# EAGLE design Master_copy_v7 (EAGLE 9.6.2)

## Sheet 1 of 2
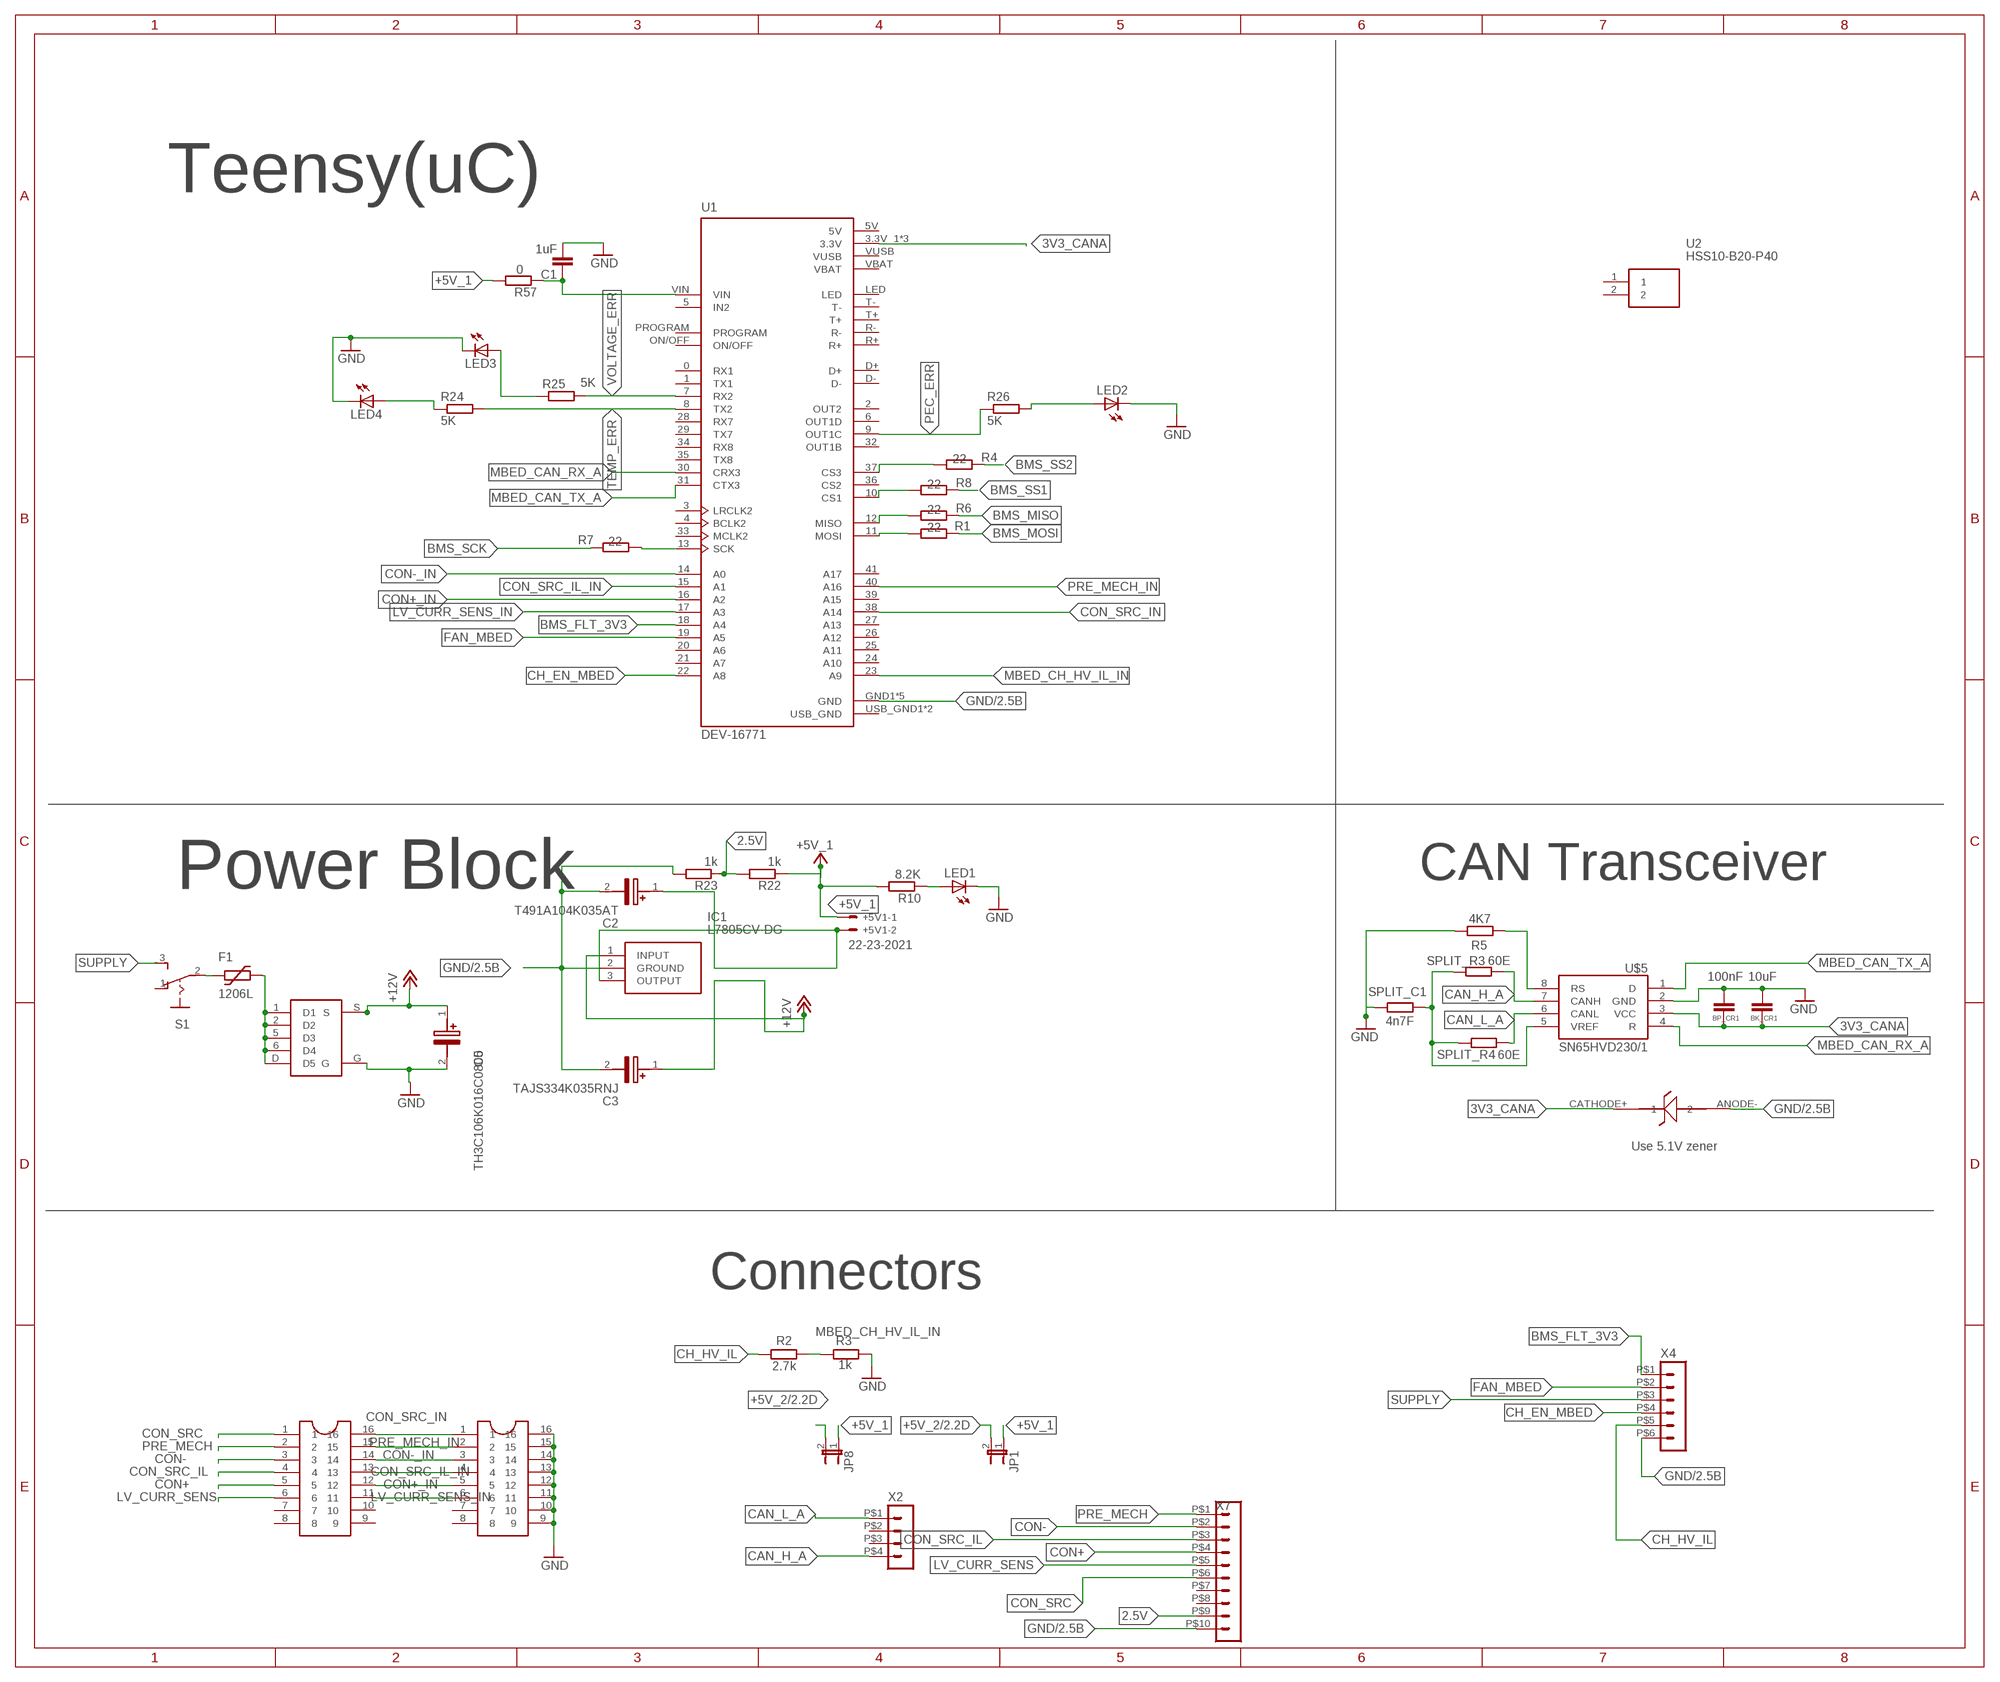
[diagram p0: schematic, sheet 1]

### Parts
+5V1  22-23-2021  [22-23-2021]
BK_CR1  10uF  C-EUC0805  [C0805]
BP_CR1  100nF  C-EUC0805  [C0805]
C1  1uF  C-EUC0805K  [C0805K]
C2  T491A104K035AT  [T491A]
C3  TAJS334K035RNJ  [CAPPM3216X120N]
C5  TH3C106K016C0800  [CAPPM6032X280N]
F1  1206L  [1206L]
IC1  L7805CV-DG  [TO255P460X1020X2008-3P]
JP1  JP1E  [JP1]
JP8  JP1E  [JP1]
LED1  LED  LEDCHIP-LED0805  [CHIP-LED0805]
LED2  LED  LEDCHIP-LED0805  [CHIP-LED0805]
LED3  LED  LEDCHIP-LED0805  [CHIP-LED0805]
LED4  LED  LEDCHIP-LED0805  [CHIP-LED0805]
R1  22  R-EU_R0805  [R0805]
R2  2.7k  R-EU_R0805  [R0805]
R3  1k  R-EU_R0805  [R0805]
R4  22  R-EU_R0805  [R0805]
R5  4K7  R-EU_R0805  [R0805]
R6  22  R-EU_R0805  [R0805]
R7  22  R-EU_R0805  [R0805]
R8  22  R-EU_R0805  [R0805]
R10  8.2K  R-EU_R0805  [R0805]
R22  1k  R-EU_R0805  [R0805]
R23  1k  R-EU_R0805  [R0805]
R24  5K  R-EU_R0805  [R0805]
R25  5K  R-EU_R0805  [R0805]
R26  5K  R-EU_R0805  [R0805]
R57  0  R-EU_R0805  [R0805]
RESISTOR_NET_2.7K  REESISTOR_NET_16  [RESISTOR_NET_16]
S1  STS121PC04  [STS121PC04]
S4  DMP3125L/SQ3419AEEV  [DMP3125L/SQ3419AEEV]
SPLIT_C1  4n7F  R-EU_R0805  [R0805]
SPLIT_R3  60E  R-EU_R0805  [R0805]
SPLIT_R4  60E  R-EU_R0805  [R0805]
U1  DEV-16771  [MODULE_DEV-16771]
U2  HSS10-B20-P40  [HSS10B20P40]
U$5  SN65HVD230/1  [SO8]
U$8  ZENER_DIODE  [SOD323HE]
U$19  REESISTOR_NET_16  [RESISTOR_NET_16]
X2  CON-MOLEX-MICRO-FIT-3_0_HEADER_POS4_43045-0412  [CON-MOLEX-MICRO-FIT-3_0_43045-0412]
X4  HEADER_POS6_43045-0612  [43045-0612]
X7  HEADER_POS10_43045-1012  [43045-1012]

### Nets
2.5V: R22.2 R23.1 X7.P$9
3V3_CANA: BK_CR1.1 BP_CR1.1 U1.3.3V_1(3.3V) U1.3.3V_2(3.3V) U1.3.3V_3(3.3V) U$5.3(VCC) U$8.CATHODE+
+5V_1: +5V1.1 JP1.1 JP8.1 R10.2 R22.1 R57.2
+5V_2: JP1.2 JP8.2 ; also sheet 2
+12V: C3.1(+) C5.1(+) IC1.1(INPUT) S4.S
BMS_FLT_3V3: U1.18(A4) X4.P$1
BMS_MISO: R6.1 ; also sheet 2
BMS_MOSI: R1.1 ; also sheet 2
BMS_SCK: R7.1 ; also sheet 2
BMS_SS1: R8.1 ; also sheet 2
BMS_SS2: R4.1 ; also sheet 2
CAN_H_A: SPLIT_R3.1 U$5.7(CANH) X2.P$4
CAN_L_A: SPLIT_R4.1 U$5.6(CANL) X2.P$1
CH_EN_MBED: U1.22(A8) X4.P$4
CH_HV_IL: R2.1 X4.P$5
CON+: RESISTOR_NET_2.7K.5 X7.P$4
CON+_IN: RESISTOR_NET_2.7K.12 U1.16(A2) U$19.5
CON-: RESISTOR_NET_2.7K.3 X7.P$2
CON-_IN: RESISTOR_NET_2.7K.14 U1.14(A0) U$19.3
CON_SRC: RESISTOR_NET_2.7K.1 X7.P$6
CON_SRC_IL: RESISTOR_NET_2.7K.4 X7.P$3
CON_SRC_IL_IN: RESISTOR_NET_2.7K.13 U1.15(A1) U$19.4
CON_SRC_IN: RESISTOR_NET_2.7K.16 U1.38(A14) U$19.1
FAN_MBED: U1.19(A5) X4.P$2
GND: BK_CR1.2 BP_CR1.2 C1.2 C2.2(-) C3.2(-) C5.2(-) IC1.2(GROUND) LED1.C LED2.C LED3.C LED4.C R3.2 R5.1 R23.2 S4.G SPLIT_C1.2 U1.GND1(GND) U1.GND2(GND) U1.GND3(GND) U1.GND4(GND) U1.GND5(GND) U$5.2(GND) U$8.ANODE- U$19.9 U$19.10 U$19.11 U$19.12 U$19.13 U$19.14 U$19.15 U$19.16 X4.P$6 X7.P$10 ; also sheet 2
LV_CURR_SENS: RESISTOR_NET_2.7K.6 X7.P$5
LV_CURR_SENS_IN: RESISTOR_NET_2.7K.11 U1.17(A3) U$19.6
MBED_CAN_RX_A: U1.30(CRX3) U$5.4(R)
MBED_CAN_TX_A: U1.31(CTX3) U$5.1(D)
MBED_CH_HV_IL_IN: R2.2 R3.1 U1.23(A9)
N$2: R4.2 U1.37(CS3)
N$3: F1.P$1 S1.2(P)
N$4: R5.2 U$5.8(RS)
N$7: R1.2 U1.11(MOSI)
N$8: R6.2 U1.12(MISO)
N$9: R8.2 U1.10(CS1)
N$10: R7.2 U1.13(SCK)
N$11: +5V1.2 C2.1(+) IC1.3(OUTPUT)
N$13: LED1.A R10.1
N$18: LED3.A R25.1
N$21: LED4.A R24.1
N$22: LED2.A R26.2
N$27: SPLIT_C1.1 SPLIT_R3.2 SPLIT_R4.2 U$5.5(VREF)
N$46: F1.P$2 S4.1(D1) S4.2(D2) S4.5(D3) S4.6(D4) S4.D(D5)
N$62: C1.1 R57.1 U1.VIN
PEC_ERR: R26.1 U1.9(OUT1C)
PRE_MECH: RESISTOR_NET_2.7K.2 X7.P$1
PRE_MECH_IN: RESISTOR_NET_2.7K.15 U1.40(A16) U$19.2
SUPPLY: S1.3(S) X4.P$3
TEMP_ERR: R24.2 U1.8(TX2)
VOLTAGE_ERR: R25.2 U1.7(RX2)
Unconnected: RESISTOR_NET_2.7K.7 RESISTOR_NET_2.7K.8 RESISTOR_NET_2.7K.9 RESISTOR_NET_2.7K.10 S1.1(O) U1.0(RX1) U1.1(TX1) U1.2(OUT2) U1.3(LRCLK2) U1.4(BCLK2) U1.5(IN2) U1.6(OUT1D) U1.20(A6) U1.21(A7) U1.24(A10) U1.25(A11) U1.26(A12) U1.27(A13) U1.28(RX7) U1.29(TX7) U1.32(OUT1B) U1.33(MCLK2) U1.34(RX8) U1.35(TX8) U1.36(CS2) U1.39(A15) U1.41(A17) U1.D+ U1.D- U1.LED U1.ON/OFF U1.PROGRAM U1.R+ U1.R- U1.T+ U1.T- U1.VBAT U1.VUSB U2.1 U2.2 U$19.7 U$19.8 X2.P$2 X2.P$3 X7.P$7 X7.P$8

### Notes on the sheet
- Teensy(uC)
- Power Block | CAN Transceiver
- Use 5.1V zener
- Connectors

## Sheet 2 of 2
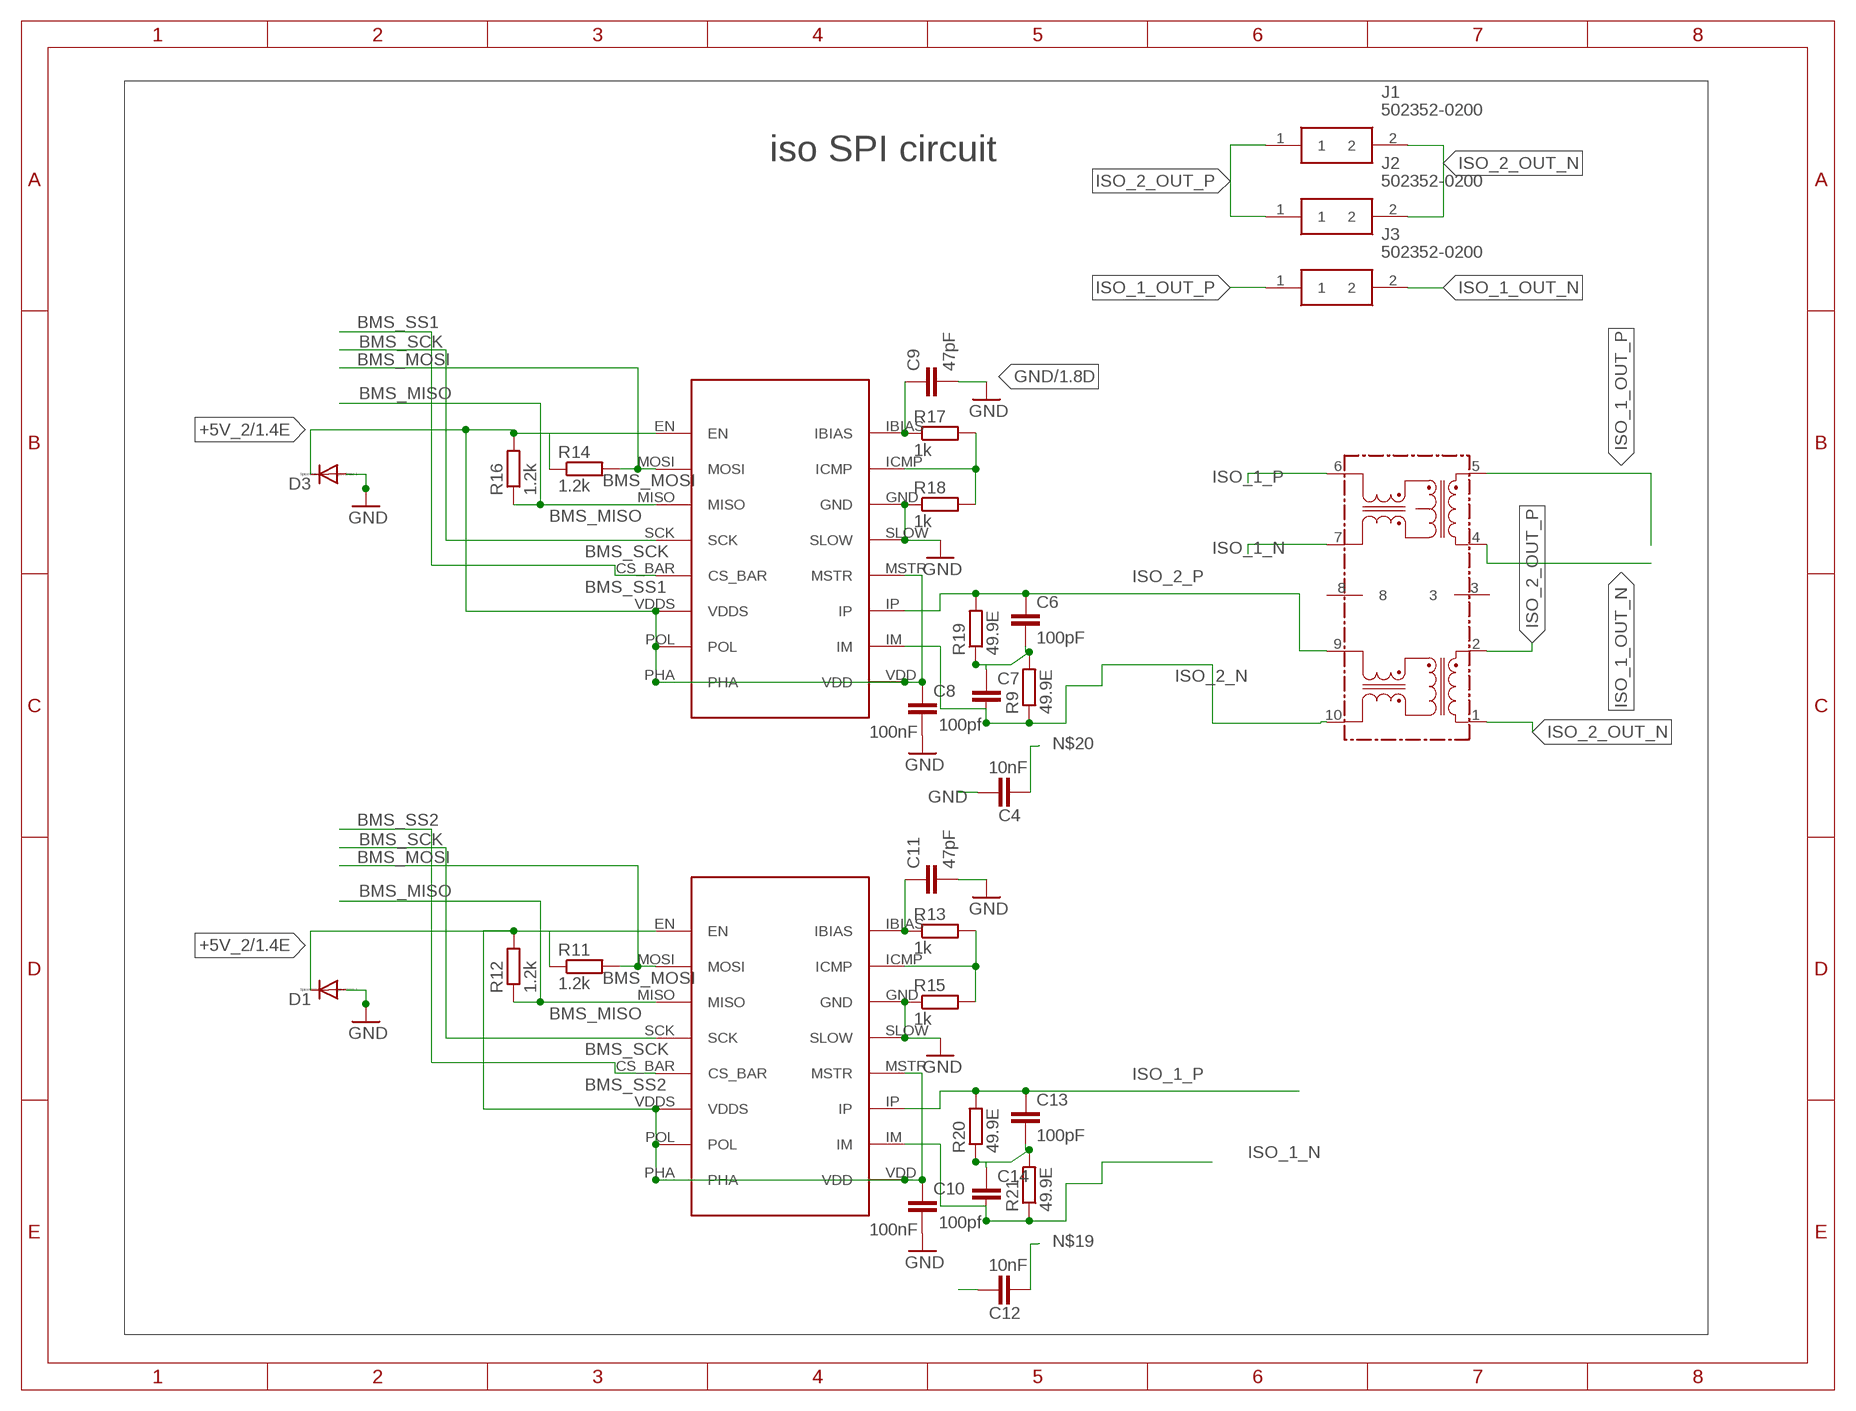
[diagram p1: schematic, sheet 2]

### Parts
C4  10nF  C-EUC0805  [C0805]
C6  100pF  C-EUC0603  [C0603]
C7  100pf  C-EUC0603  [C0603]
C8  100nF  C-EUC0805  [C0805]
C9  47pF  C-EUC0805  [C0805]
C10  100nF  C-EUC0805  [C0805]
C11  47pF  C-EUC0805  [C0805]
C12  10nF  C-EUC0805  [C0805]
C13  100pF  C-EUC0603  [C0603]
C14  100pf  C-EUC0603  [C0603]
D1  DIODE-SOD123  [SOD123]
D3  DIODE-SOD123  [SOD123]
J1  502352-0200  [5023520200]
J2  502352-0200  [5023520200]
J3  502352-0200  [5023520200]
R9  49.9E  R-EU_R0805  [R0805]
R11  1.2k  R-EU_R0805  [R0805]
R12  1.2k  R-EU_R0805  [R0805]
R13  1k  R-EU_R0805  [R0805]
R14  1.2k  R-EU_R0805  [R0805]
R15  1k  R-EU_R0805  [R0805]
R16  1.2k  R-EU_R0805  [R0805]
R17  1k  R-EU_R0805  [R0805]
R18  1k  R-EU_R0805  [R0805]
R19  49.9E  R-EU_R0805  [R0805]
R20  49.9E  R-EU_R0805  [R0805]
R21  49.9E  R-EU_R0805  [R0805]
U$1  LTC6820  [16-PINMSOP]
U$2  HM2100NL  [HM2100NL]
U$4  LTC6820  [16-PINMSOP]

### Nets
+5V_2: C8.1 C10.1 D1.C D3.C R11.1 R12.2 R14.1 R16.2 U$1.EN U$1.MSTR U$1.PHA U$1.POL U$1.VDD U$1.VDDS U$4.EN U$4.MSTR U$4.PHA U$4.POL U$4.VDD U$4.VDDS ; also sheet 1
BMS_MISO: R12.1 R16.1 U$1.MISO U$4.MISO ; also sheet 1
BMS_MOSI: R11.2 R14.2 U$1.MOSI U$4.MOSI ; also sheet 1
BMS_SCK: U$1.SCK U$4.SCK ; also sheet 1
BMS_SS1: U$1.CS_BAR ; also sheet 1
BMS_SS2: U$4.CS_BAR ; also sheet 1
GND: C4.1 C8.2 C9.2 C10.2 C11.2 C12.1 D1.A D3.A R15.1 R18.1 U$1.GND U$1.SLOW U$4.GND U$4.SLOW ; also sheet 1
ISO_1_N: C14.2 R21.1 U$2.7 U$4.IM
ISO_1_OUT_N: J3.2 U$2.4
ISO_1_OUT_P: J3.1 U$2.5
ISO_1_P: C13.1 R20.2 U$2.6 U$4.IP
ISO_2_N: C7.2 R9.1 U$1.IM U$2.10
ISO_2_OUT_N: J1.2 J2.2 U$2.1
ISO_2_OUT_P: J1.1 J2.1 U$2.2
ISO_2_P: C6.1 R19.2 U$1.IP U$2.9
N$12: R17.2 R18.2 U$1.ICMP
N$14: C9.1 R17.1 U$1.IBIAS
N$16: R13.2 R15.2 U$4.ICMP
N$17: C11.1 R13.1 U$4.IBIAS
N$19: C12.2 C13.2 C14.1 R20.1 R21.2
N$20: C4.2 C6.2 C7.1 R9.2 R19.1
Unconnected: U$2.3 U$2.8

### Notes on the sheet
- iso SPI circuit

## Power pins joined to a net without a drawn wire
5V: U1.5V
USB_GND: U1.USB_GND1(USB_GND) U1.USB_GND2(USB_GND)

## Library data of the parts
+5V1 = con-molex:22-23-2021: .100" (2.54mm) Center Header - 2 Pin; MF: MOLEX; MPN: 22-23-2021; OC_FARNELL: 1462926; OC_NEWARK: 25C3832
BK_CR1 BP_CR1 C4 C8-C12 = rcl:C-EU: CAPACITOR, European symbol; SPICEPREFIX: C
C1 C6 C7 C13 C14 = IIT_BOMBAY_Racing-1:C-EU: CAPACITOR, European symbol
C2 = SamacSys_Parts:T491A104K035AT: T491, Tantalum, MnO2 Tantalum, Commercial Grade, .1 uF, 10%, 35 VDC, 125?C, -55?C, 85?C, SMD, MnO2, Molded, 4 % , 20 Ohms, 500 nA, 58.6 mg, 3216, 1.6mm, Height Max = 1.8mm, 2000, 156 Weeks Source: Datasheet <https://content.kemet.com/datasheets/KEM_T2005_T491.pdf>; DESCRIPTION: T491, Tantalum, MnO2 Tantalum, Commercial Grade, .1 uF, 10%, 35 VDC, 125?C, -55?C, 85?C, SMD, MnO2, Molded, 4 % , 20 Ohms, 500 nA, 58.6 mg, 3216, 1.6mm, Height Max = 1.8mm, 2000, 156 Weeks; HEIGHT: 1.8mm; MANUFACTURER_NAME: KEMET; MANUFACTURER_PART_NUMBER: T491A104K035AT; MOUSER_PART_NUMBER: 80-T491A104K035; MOUSER_PRICE-STOCK: https://www.mouser.co.uk/ProductDetail/KEMET/T491A104K035AT?qs=VCf6WUQjPgHZen45Mmzj1w%3D%3D
C3 = SamacSys_Parts:TAJS334K035RNJ: AVX - TAJS334K035RNJ - CAP, TANT, 330NF, 35V, CASE S Source: Datasheet <http://datasheets.avx.com/TAJ.pdf>; DESCRIPTION: AVX - TAJS334K035RNJ - CAP, TANT, 330NF, 35V, CASE S; HEIGHT: 1.2mm; MANUFACTURER_NAME: AVX; MANUFACTURER_PART_NUMBER: TAJS334K035RNJ; MOUSER_PART_NUMBER: 581-TAJS334K035RNJ; MOUSER_PRICE-STOCK: https://www.mouser.co.uk/ProductDetail/AVX/TAJS334K035RNJ?qs=vvquVF4vQRkJRvRkvcVUbg%3D%3D
C5 = SamacSys_Parts:TH3C106K016C0800: Solid Tantalum Surface Mount Capacitors TANTAMOUNT(TM) Molded Case, HI-TMP High Temperature 150 C, Automotive Grade Source: Datasheet <http://www.vishay.com/doc?40084>; DESCRIPTION: Solid Tantalum Surface Mount Capacitors TANTAMOUNT(TM) Molded Case, HI-TMP High Temperature 150 C, Automotive Grade; HEIGHT: 2.8mm; MANUFACTURER_NAME: Vishay; MANUFACTURER_PART_NUMBER: TH3C106K016C0800; MOUSER_PART_NUMBER: 74-TH3C106K016C0800; MOUSER_PRICE-STOCK: https://www.mouser.co.uk/ProductDetail/Vishay-Sprague/TH3C106K016C0800?qs=l4Gc20tDgJLNAEbL48SStQ%3D%3D
D1 D3 = IIT_BOMBAY_Racing-1:DIODE-: DIODE
F1 = IIT_BOMBAY_Racing:1206L
IC1 = SamacSys_Parts:L7805CV-DG: Voltage Regulator 5V 4% 1.5A TO220 L7805CV-DG, Linear Voltage Regulator, Current Limit, Shut-Down 1.5A 5 V, 3-Pin TO220 Source: Datasheet <http://www.st.com/web/en/resource/technical/document/datasheet/CD00000444.pdf>; DESCRIPTION: Voltage Regulator 5V 4% 1.5A TO220 L7805CV-DG, Linear Voltage Regulator, Current Limit, Shut-Down 1.5A 5 V, 3-Pin TO220; HEIGHT: 4.6mm; MANUFACTURER_NAME: STMicroelectronics; MANUFACTURER_PART_NUMBER: L7805CV-DG; MOUSER_PART_NUMBER: 511-L7805CV-DG; MOUSER_PRICE-STOCK: https://www.mouser.co.uk/ProductDetail/STMicroelectronics/L7805CV-DG?qs=T%2FOtf55vL7c3O0as9P9fAw%3D%3D
J1-J3 = SamacSys_Parts:502352-0200: Molex DURACLIK 502352, 2mm Pitch, 2 Way, 1 Row, Right Angle PCB Header, Surface Mount Source: Datasheet <https://www.molex.com/pdm_docs/sd/5023520200_sd.pdf>; DESCRIPTION: Molex DURACLIK 502352, 2mm Pitch, 2 Way, 1 Row, Right Angle PCB Header, Surface Mount; HEIGHT: mm; MANUFACTURER_NAME: Molex; MANUFACTURER_PART_NUMBER: 502352-0200; MOUSER_PART_NUMBER: 538-502352-0200; MOUSER_PRICE-STOCK: https://www.mouser.co.uk/ProductDetail/Molex/502352-0200?qs=cPOO8qjhL6OPJnOOkJoW%252Bw%3D%3D
JP1 JP8 = jumper:JP1E: JUMPER
LED1-LED4 = led:LED: LED OSRAM: - CHIPLED LG R971, LG N971, LY N971, LG Q971, LY Q971, LO R971, LY R971 LH N974, LH R974 LS Q976, LO Q976, LY Q976 LO Q996 - Hyper CHIPLED LW Q18S LB Q993, LB Q99A, LB R99A - SideLED LS A670, LO A670, LY A670, LG A670, LP A670 LB A673, LV A673, LT A673, LW A673 LH A674 LY A675 LS A676, LA A676, LO A676, LY A676, LW A676 LS A679, LY A679, LG A679 - Hyper Micro SIDELED® LS Y876, LA Y876, LO Y876, LY Y876 LT Y87S - SmartLED LW L88C, LW L88S LB L89C, LB L89S, LG L890 LS L89K, LO L89K, LY L89K LS L896, LA L896, LO L896, LY L896 - TOPLED LS T670, LO T670, LY T670, LG T670, LP T670 LSG T670, LSP T670, LSY T670, LOP T670, LYG T670 LG T671, LOG T671, LSG T671 LB T673, LV T673, LT T673, LW T673 LH T674 LS T676, LA T676, LO T676, LY T676, LB T676, LH T676, LSB T676, LW T676 LB T67C, LV T67C, LT T67C, LS T67K, LO T67K, LY T67K, LW E67C LS E67B, LA E67B, LO E67B, LY E67B, LB E67C, LV E67C, LT E67C LW T67C LS T679, LY T679, LG T679 LS T770, LO T770, LY T770, LG T770, LP T770 LB T773, LV T773, LT T773, LW T773 LH T774 LS E675, LA E675, LY E675, LS T675 LS T776, LA T776, LO T776, LY T776, LB T776 LHGB T686 LT T68C, LB T68C - Hyper Mini TOPLED® LB M676 - Mini TOPLED Santana® LG M470 LS M47K, LO M47K, LY M47K Source: http://www.osram.convergy.de LUXEON: - LUMILED® LXK2-PW12-R00, LXK2-PW12-S00, LXK2-PW14-U00, LXK2-PW14-V00 LXK2-PM12-R00, LXK2-PM12-S00, LXK2-PM14-U00 LXK2-PE12-Q00, LXK2-PE12-R00, LXK2-PE12-S00, LXK2-PE14-T00, LXK2-PE14-U00 LXK2-PB12-K00, LXK2-PB12-L00, LXK2-PB12-M00, LXK2-PB14-N00, LXK2-PB14-P00, LXK2-PB14-Q00 LXK2-PR12-L00, LXK2-PR12-M00, LXK2-PR14-Q00, LXK2-PR14-R00 LXK2-PD12-Q00, LXK2-PD12-R00, LXK2-PD12-S00 LXK2-PH12-R00, LXK2-PH12-S00 LXK2-PL12-P00, LXK2-PL12-Q00, LXK2-PL12-R00 Source: www.luxeon.com KINGBRIGHT: KA-3528ASYC Source: www.kingbright.com; MID: SML-D12M1WT86
R1 R4 R6-R8 R57 = IIT_BOMBAY_Racing:R-EU_: RESISTOR, European symbol
R2 R3 R5 SPLIT_C1 SPLIT_R3 SPLIT_R4 = IIT_BOMBAY_Racing-1:R-EU_: RESISTOR, European symbol
R9 R11-R21 R24-R26 = rcl:R-EU_: RESISTOR, European symbol; SPICEPREFIX: R
R10 R22 R23 = resistor:R-EU_: RESISTOR, European symbol; MID: ERJ-P06J822V
RESISTOR_NET_2.7K U$19 = Resistor_net:REESISTOR_NET_16
S1 = switches:STS121PC04: SLIDING SWITCH Distributor Buerklin, 11G810
S4 = SQ3419Pmos:DMP3125L/SQ3419AEEV
U1 = teensy4.1:DEV-16771: RT1062 Teensy 4.1 i.MX ARM Cortex-M7 MPU Embedded Evaluation Board Check availability <https://pricing.snapeda.com/parts/DEV-16771/SparkFun%20Electronics/view-part?ref=eda>; AVAILABILITY: In Stock; DESCRIPTION: RT1062 Teensy 4.1 series ARM® Cortex®-M7 MPU Embedded Evaluation Board; MF: SparkFun Electronics; MP: DEV-16771; PACKAGE: None; PRICE: None; PURCHASE-URL: https://pricing.snapeda.com/search/part/DEV-16771/?ref=eda
U2 = SamacSys_Parts:HSS10-B20-P40: Heat Sinks heat sink, stamping, TO-220, 29.97 x 25. Source: Datasheet <https://www.cuidevices.com/product/resource/hss10-b20-p40.pdf>; DESCRIPTION: Heat Sinks heat sink, stamping, TO-220, 29.97 x 25.; HEIGHT: 29.97mm; MANUFACTURER_NAME: CUI Inc.; MANUFACTURER_PART_NUMBER: HSS10-B20-P40; MOUSER_PART_NUMBER: 490-HSS10-B20-P40; MOUSER_PRICE-STOCK: https://www.mouser.co.uk/ProductDetail/CUI-Devices/HSS10-B20-P40?qs=QNEnbhJQKvYYvwy4FCjq1A%3D%3D
U$1 U$4 = IIT_BOMBAY_Racing:LTC6820
U$2 = HM2100NL:HM2100NL
U$5 = texas_1:SN65HVD230/1
U$8 = mylib:ZENER_DIODE
X2 = LV Safety:CON-MOLEX-MICRO-FIT-3_0_HEADER_POS4_?: Molex - Micro-Fit 3.0 Series connector, 3.00mm (0.118") pitch header, 4 positions.
X4 = IIT_BOMBAY_Racing2:HEADER_POS6_?: Molex - Micro-Fit 3.0 Series connector, 3.00mm (0.118") pitch header, 6 positions.
X7 = IIT_BOMBAY_Racing2:HEADER_POS10_?: Molex - Micro-Fit 3.0 Series connector, 3.00mm (0.118") pitch header, 10 positions.

## Net classes
0 default: width 0.127 mm, drill 0.127 mm, clearance 0.127 mm

## Board
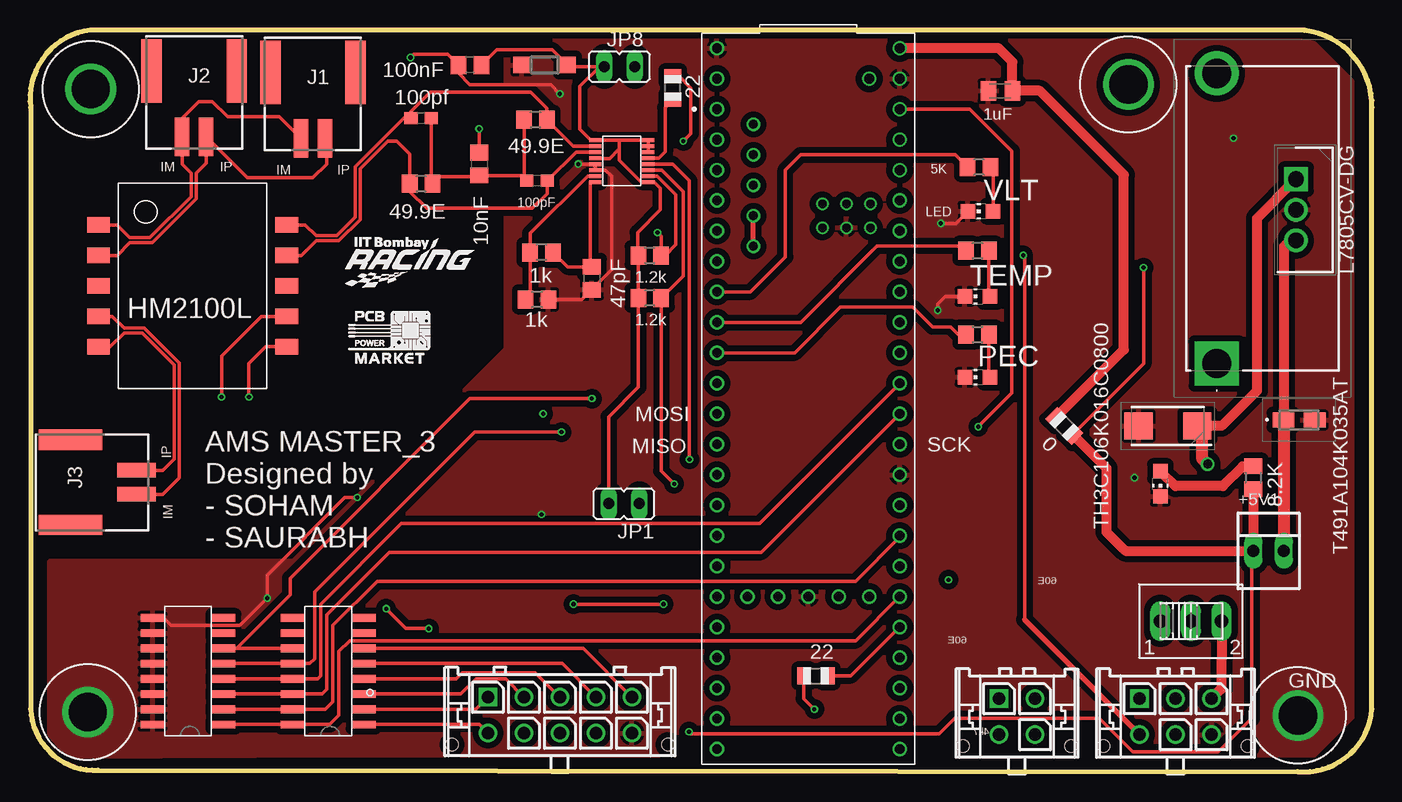
[diagram p2: board, top side]
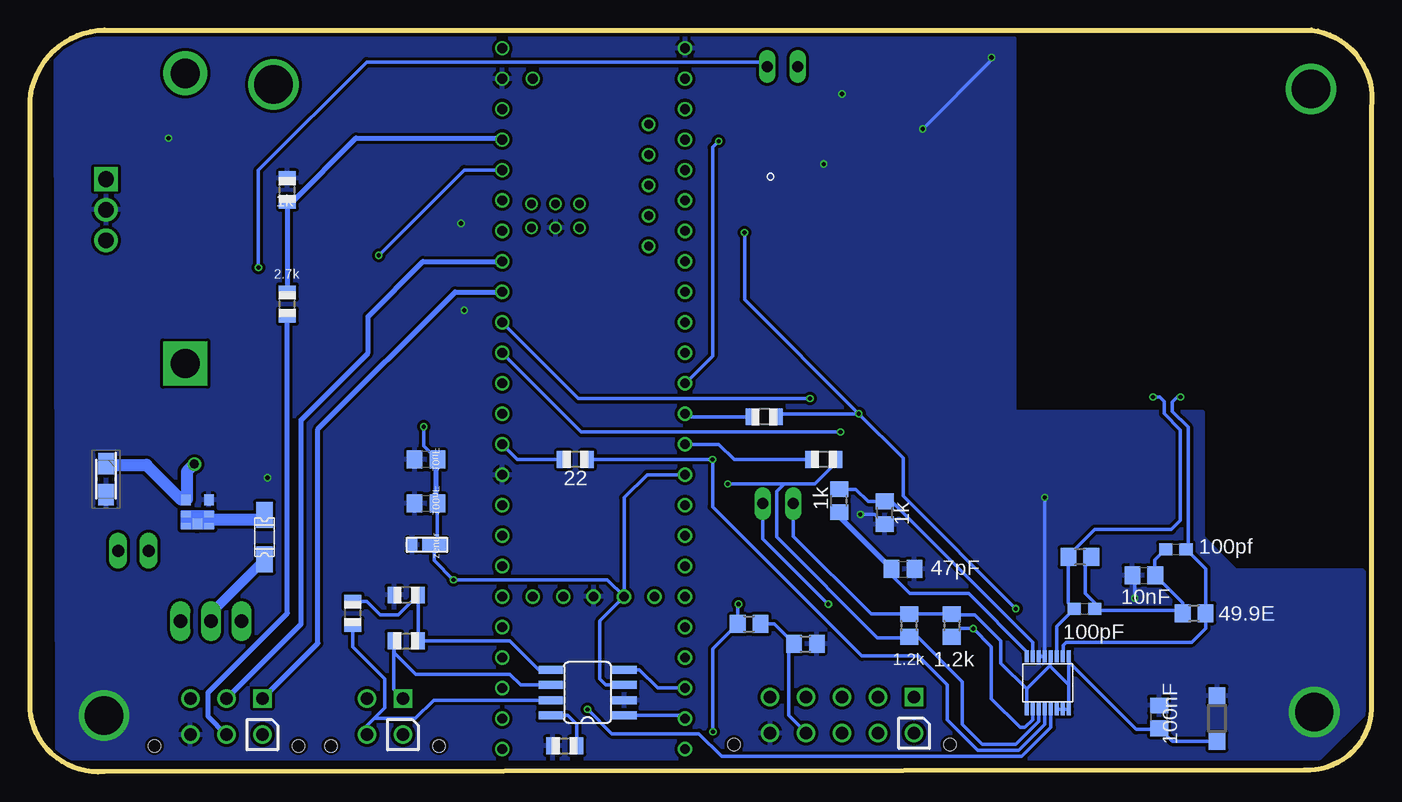
[diagram p3: board, bottom side, seen from below]

Size 111.83 x 61.87 mm. Coordinates in mm from the lower left corner, seen from the top.
Outline: 105.62,61.87 5.04,61.87 arc90 0.04,55.39 0.04,5.23 arc90 5.68,0.15 105.62,0.02 arc90 111.83,5.23 111.83,55.39 arc90 105.62,61.87
Copper layers (1*16): Top 0.035mm / dielectric 1.5mm / Bottom 0.035mm
Design rules "PCB_Power": minimum track width 5mil, minimum drill 10mil, track to track 5mil, track to pad 5mil, pad to pad 5mil, via to via 5mil, smd to smd 5mil, copper to edge 10mil, drill to drill 6mil, minimum pad ring 5mil, minimum via ring 5mil, stop-mask expansion 3mil, vias tented up to drill 0mil, thermal gap 10mil

### Footprints (pad centres in the part's own frame; a part is rotated, then mirrored left to right if it is on the bottom)
22-23-2021 = drill 1 long: 1 -1.27,0; 2 1.27,0
C0805 = smd 1.3 x 1.5: 1 -0.95,0; 2 0.95,0
C0805K = smd 1.3 x 1.6: 1 -1,0; 2 1,0
T491A = smd 1.8 x 1.23: 1 -1.31,0; 2 1.31,0
CAPPM3216X120N = smd 1.8 x 1.3: 1 -1.3,0; 2 1.3,0
CAPPM6032X280N = smd 2.35 x 2.25: 1 -2.45,0; 2 2.45,0
C0603 = smd 1.1 x 1: 1 -0.85,0; 2 0.85,0
SOD123 = smd 1.4 x 1.4: A 1.9,0; C -1.9,0
1206L = smd 2.16 x 1.4: P$1 -1.85,0; P$2 1.85,0
TO255P460X1020X2008-3P = drill 1.32 pad 1.98 square: 1 0,0 | drill 1.32 pad 1.98: 2 2.55,0; 3 5.1,0
5023520200 = smd 1.2 x 3.2: 1 -1,-1; 2 1,-1 | smd 1.7 x 5.3: 3 -3.55,-6.48; 4 3.55,-6.48
JP1 = drill 0.914 long: 1 0,-1.27; 2 0,1.27
CHIP-LED0805 = smd 1.2 x 1.2: A 0,-1.05; C 0,1.05
R0805 = smd 1.1 x 1.4: 1 -1,0; 2 1,0
R0805' = smd 1.3 x 1.5: 1 -0.95,0; 2 0.95,0
RESISTOR_NET_16 = smd 0.635 x 2.007: 1 -4.318,-2.95; 2 -3.048,-2.95; 3 -1.778,-2.95; 4 -0.508,-2.95; 5 0.762,-2.95; 6 2.032,-2.95; 7 3.302,-2.95; 8 4.572,-2.95; 9 4.572,2.95; 10 3.302,2.95; 11 2.032,2.95; 12 0.762,2.95; 13 -0.508,2.95; 14 -1.778,2.95; 15 -3.048,2.95; 16 -4.318,2.95
STS121PC04 = drill 1.118 long: 1 -3.81,0; 2 -1.27,0; 3 1.29,0
DMP3125L/SQ3419AEEV = smd 0.51 x 0.8: 1 -2.64,-0.95; 2 -1.64,-0.95; 5 -1.64,0.95; 6 -2.64,0.95 | smd 0.9 x 0.8: D -2.45,0; G -0.45,-0.95; S -0.45,0.95
MODULE_DEV-16771 = drill 0.8: 0 -26.67,-7.62; 1 -24.13,-7.62; 2 -21.59,-7.62; 3 -19.05,-7.62; 3.3V_1 6.35,-7.62; 3.3V_2 -24.13,7.62; 3.3V_3 16.51,-2.54; 4 -16.51,-7.62; 5 -13.97,-7.62; 6 -11.43,-7.62; 7 -8.89,-7.62; 8 -6.35,-7.62; 9 -3.81,-7.62; 10 -1.27,-7.62; 11 1.27,-7.62; 12 3.81,-7.62; 13 3.81,7.62; 14 1.27,7.62; 15 -1.27,7.62; 16 -3.81,7.62; 17 -6.35,7.62; 18 -8.89,7.62; 19 -11.43,7.62; 20 -13.97,7.62; 21 -16.51,7.62; 22 -19.05,7.62; 23 -21.59,7.62; 24 8.89,-7.62; 25 11.43,-7.62; 26 13.97,-7.62; 27 16.51,-7.62; 28 19.05,-7.62; 29 21.59,-7.62; 30 24.13,-7.62; 31 26.67,-7.62; 32 29.21,-7.62; 33 29.21,7.62; 34 26.67,7.62; 35 24.13,7.62; 36 21.59,7.62; 37 19.05,7.62; 38 16.51,7.62; 39 13.97,7.62; 40 11.43,7.62; 41 8.89,7.62; GND1 -29.21,-7.62; GND2 6.35,7.62; GND3 -26.67,7.62; GND4 16.51,0; ON/OFF 16.51,5.08; PROGRAM 16.51,2.54; VBAT 16.51,-5.08; VIN -29.21,7.62; VUSB -26.67,5.08 | drill 0.75: 5V -22.86,-4.57; D+ -17.78,-4.57; D- -20.32,-4.57; USB_GND1 -15.24,-4.57; USB_GND2 -12.7,-4.57 | drill 0.7: GND5 -14.24,3.17; LED -16.24,3.17; R+ -16.24,5.17; R- -14.24,5.17; T+ -14.24,1.17; T- -16.24,1.17
HSS10B20P40 = drill 2.45 pad 3.675 square: 1 0,0 | drill 2.45 pad 3.675: 2 24.2,0
16-PINMSOP = smd 0.343 x 1.016: CS_BAR 0.12,-2.27; EN -1.879,-2.27; GND -0.879,2.13; IBIAS -1.879,2.13; ICMP -1.379,2.13; IM 1.121,2.13; IP 0.621,2.13; MISO -0.879,-2.27; MOSI -1.379,-2.27; MSTR 0.12,2.13; PHA 1.621,-2.27; POL 1.121,-2.27; SCK -0.38,-2.27; SLOW -0.38,2.13; VDD 1.621,2.13; VDDS 0.621,-2.27
HM2100NL = smd 1.27 x 1.89: 1 -5.08,-7.84; 2 -2.54,-7.84; 3 0,-7.84; 4 2.54,-7.84; 5 5.08,-7.84; 6 5.08,7.84; 7 2.54,7.84; 8 0,7.84; 9 -2.54,7.84; 10 -5.08,7.84
SO8 = smd 0.66 x 2.032: 1 -1.905,-3.073; 2 -0.635,-3.073; 3 0.635,-3.073; 4 1.905,-3.073; 5 1.905,3.073; 6 0.635,3.073; 7 -0.635,3.073; 8 -1.905,3.073
SOD323HE = smd 1.092 x 0.787: ANODE- 0,0 | smd 1.092 x 2.007: CATHODE+ 0,-1.829
CON-MOLEX-MICRO-FIT-3_0_43045-0412 = drill 1.02 square: P$1 1.5,0 | drill 1.02: P$2 -1.5,0; P$3 1.5,3; P$4 -1.5,3 | hole 1.02: 4.5,3.94; -4.5,3.94
43045-0612 = drill 1.02 square: P$1 3,0 | drill 1.02: P$2 0,0; P$3 -3,0; P$4 3,3; P$5 0,3; P$6 -3,3 | hole 1.02: 6,3.94; -6,3.94
43045-1012 = drill 1.02 square: P$1 6,0 | drill 1.02: P$2 3,0; P$3 0,0; P$4 -3,0; P$5 -6,0; P$6 6,3; P$7 3,3; P$8 0,3; P$9 -3,3; P$10 -6,3 | hole 1.02: 9,3.94; -9,3.94

### Placement (x,y rotation side)
+5V1  103.21,18.44 0 top
BK_CR1  78.83,26.06 180 bottom
BP_CR1  78.83,22.37 180 bottom
C1  80.86,56.79 180 top
C2  105.75,29.36 0 top
C3  105.5,24.41 270 bottom
C4  37.43,50.69 270 top
C5  94.83,28.85 180 top
C6  42.25,49.3 180 top
C7  32.6,54.5 180 top
C8  17.74,4.59 90 bottom
C9  46.82,41.17 270 top
C10  36.66,58.95 180 top
C11  39.08,16.91 0 bottom
C12  19.01,16.4 0 bottom
C13  23.96,13.61 0 bottom
C14  16.34,18.56 0 bottom
D1  42.89,58.95 180 top
D3  12.91,4.47 90 bottom
F1  92.29,19.58 90 bottom
IC1  105.5,49.42 270 top
J1  23.58,51.84 180 top
J2  13.68,51.96 180 top
J3  9.87,24.15 270 top
JP1  49.49,22.37 90 top
JP8  49.11,58.82 90 top
LED1  94.19,24.02 180 top
LED2  78.95,32.91 90 top
LED3  79.21,46.76 90 top
LED4  78.95,39.65 90 top
R1  50.63,29.61 180 bottom
R2  90.38,39.01 90 bottom
R3  90.38,48.54 90 bottom
R4  65.49,8.02 0 top
R5  67.27,2.18 0 bottom
R6  45.68,26.06 180 bottom
R7  66.38,26.06 180 bottom
R8  53.55,57.04 90 top
R9  49.9E  [R0805']  42.12,54.38 180 top
R10  8.2K  [R0805']  101.94,24.53 270 top
R11  1.2k  [R0805']  51.65,43.07 0 top
R12  1.2k  [R0805']  51.65,39.52 180 top
R13  1k  [R0805']  44.41,22.63 90 bottom
R14  1.2k  [R0805']  35.01,12.21 270 bottom
R15  1k  [R0805']  40.6,21.61 90 bottom
R16  1.2k  [R0805']  38.57,12.21 90 bottom
R17  1k  [R0805']  42.63,43.33 180 top
R18  1k  [R0805']  42.25,39.39 180 top
R19  49.9E  [R0805']  32.6,49.04 180 top
R20  49.9E  [R0805']  24.34,17.93 180 bottom
R21  49.9E  [R0805']  14.82,13.23 180 bottom
R22  1k  [R0805']  51.9,12.34 0 bottom
R23  1k  [R0805']  47.2,10.69 0 bottom
R24  5K  [R0805']  78.95,43.46 180 top
R25  5K  [R0805']  79.08,50.44 180 top
R26  5K  [R0805']  78.95,36.47 0 top
R57  86.19,28.85 315 top
RESISTOR_NET_2.7K  24.85,8.28 90 top
S1  98,12.59 0 top
S4  97.88,23.14 90 bottom
SPLIT_C1  80.48,14.75 180 bottom
SPLIT_R3  84.92,13.23 90 bottom
SPLIT_R4  80.48,10.94 0 bottom
U1  64.86,31.14 270 top
U2  98.89,34.06 90 top
U$1  49.24,51.08 90 top
U$2  13.55,40.53 270 top
U$3  [IITBR_LOGO]  26.21,40.34 0 top
U$4  26.88,7.51 0 bottom
U$5  65.37,6.63 90 bottom
U$7  LOGO_PCBPOWER  [270X170]  26.5,34.06 0 top
U$8  79.97,18.94 90 bottom
U$19  13.17,8.28 90 top
X2  82.26,6.12 180 top
X4  95.46,6.12 180 top
X7  44.16,6.24 180 top

### Tracks (layer width: path | path; a pad name or v marks a point on that pad's centre or on a via)
2.5V
  Bottom 0.305: R22.2 49.81,12.34 R23.1 48.6,10.24 48.6,4.72 47.16,3.28 X7.P$9
3V3_CANA  (via drill 0.35)
  Top 0.305: v79.02,28.79 81.81,31.58 81.81,51.77 78.32,55.27 U1.3.3V_2
  Bottom 0.305: v79.02,28.79 79.02,27.2 BK_CR1.1 | U$5.3 63.84,7.26 64.35,7.77 64.35,12.59 U1.3.3V_3 | BP_CR1.1 77.88,19.21 U$8.CATHODE+ 78.14,17.62 v76.54,16.02 63.71,16.02 U1.3.3V_3 | U1.3.3V_1 60.41,24.79 62.32,22.88 U1.3.3V_3
  Bottom 0.406: BK_CR1.1 78,25.93 78,22.5 BP_CR1.1
+5V_1  (via drill 0.35)
  Top 0.305: +5V1.1 101.81,18.31 101.81,4.47 99.02,1.67 91.91,1.67 89.11,4.47 77.05,4.47 75.78,3.2 55.08,3.2 v54.92,3.35 | R57.2 92.8,34.04 v92.8,42.06 | v45.3,13.99 v52.79,13.99
  Top 0.813: R10.2 +5V1.1 91.27,18.44 89.69,20.02 89.69,25.35 R57.2
  Bottom 0.305: v92.8,42.06 92.8,50.19 83.78,59.2 50.76,59.2 JP8.1 | JP1.1 50.76,19.45 v45.3,13.99 | v54.92,3.35 54.92,10.27 R22.1 52.85,13.93 v52.79,13.99
+5V_2
  Top 0.152: 50.93,49.2 U$1.EN
  Top 0.305: U$1.VDDS U$1.POL U$1.PHA 49.11,52.7 | 49.11,52.7 U$1.VDD 47.08,52.73 46.7,52.73 45.81,53.62 45.81,57.17 47.46,58.82 JP8.2 44.91,58.82 D1.C 43.52,60.22 38.88,60.22 C10.1 | 49.11,52.7 49.11,51.96 | 49.11,51.96 48.29,51.15 47.16,51.15 U$1.MSTR | 49.11,51.96 49.11,51.02 50.93,49.2 | U$1.EN 52,49.2 52.54,48.66 52.54,46.88 50.63,44.98 50.63,43.14 R11.1 R12.2 50.7,32.09 48.22,29.61 JP1.2
  Bottom 0.305: JP1.2 48.22,19.64 41.74,13.16 R16.2 R14.1 34.95,13.1 33.11,13.1 30.95,10.94 30.95,9.08 28.79,6.92 | 25.26,7.26 U$4.PHA U$4.POL U$4.VDDS | 25.26,7.26 25.26,9.17 | 25.26,9.17 U$4.VDD | D3.C 16.66,2.57 C8.1 17.84,3.55 19.65,3.55 25.26,9.17 | U$4.EN 28.79,5.27 28.79,6.92 | U$4.MSTR 26.81,9.6 26.81,8.89 | 26.81,8.89 28.79,6.92 | 26.81,8.89 26.81,8.81 25.26,7.26
+12V  (via drill 0.75)
  Top 0.813: IC1.1 102.23,46.16 102.23,31.77 99.31,28.85 C5.1
  Top 1.016: C5.1 97.66,28.85 97.66,26.15 v98.13,25.68
  Bottom 1.016: C3.1 105.4,25.61 102.13,25.61 99.21,22.69 S4.S 98.77,22.75 98.77,25.04 v98.13,25.68
BMS_FLT_3V3
  Bottom 0.406: X4.P$1 87.84,10.74 87.84,28.6 76.41,40.03 U1.18
BMS_MISO  (via drill 0.35)
  Top 0.305: U$1.MISO 52.66,50.2 54.44,48.41 54.44,41.36 R12.1 52.6,25.11 v53.68,24.02
  Bottom 0.305: U$4.MISO 27.76,4.22 29.68,2.31 32.47,2.31 34.12,3.96 34.12,7.51 37.87,11.26 R16.1 38.63,11.2 41.24,11.2 49.62,19.58 49.62,23.39 48.98,24.02 | R6.1 44.68,25.79 46.44,24.02 48.98,24.02 | v53.68,24.02 48.98,24.02
BMS_MOSI  (via drill 0.35)
  Top 0.305: U$1.MOSI 52.27,49.7 53.81,48.15 53.81,43.96 52.92,43.07 | R11.2 52.6,44.66 v52.28,44.98 | v33.23,11.96 31.33,11.96 v29.68,13.61
  Top 0.406: R11.2 52.92,43.07
  Bottom 0.305: v52.28,44.98 52.28,39.39 v42.76,29.87 | R1.1 49.62,29.61 49.36,29.87 v42.76,29.87 | U$4.MOSI 28.26,4.36 28.92,3.7 29.3,3.7 31.71,6.12 31.71,10.44 v33.23,11.96 34.32,11.96 R14.2 | v29.68,13.61 39.08,23.01 39.08,26.18 v42.76,29.87
BMS_SCK  (via drill 0.35)
  Top 0.305: U$1.SCK 53.55,50.7 54.95,49.3 v54.95,26.06
  Bottom 0.305: U$4.SCK 27.27,3.96 29.42,1.8 32.85,1.8 35.39,4.34 35.39,7.26 37.81,9.67 42.51,9.67 54.95,22.12 v54.95,26.06 R7.1
BMS_SS1
  Top 0.305: U$1.CS_BAR 52.41,51.2 52.92,51.71 52.92,55.41 R8.1
BMS_SS2  (via drill 0.35)
  Top 0.305: R4.1 64.48,8.01 64.48,6.12 v65.37,5.23
  Bottom 0.305: v65.37,5.23 63.33,3.2 56.09,3.2 54.19,1.29 29.17,1.29 26.76,3.7 U$4.CS_BAR
CAN_H_A
  Bottom 0.305: 83.15,4.47 79.72,4.47 78.19,5.99 U$5.7 | 83.15,4.47 83.76,3.86 X2.P$4 | 83.15,4.47 82.26,5.36 82.26,7.78 84.92,10.45 SPLIT_R3.1
CAN_L_A
  Bottom 0.305: U$5.6 70.95,7.26 71.84,8.15 79.7,8.15 81.48,9.93 SPLIT_R4.1 81.52,10.98 81.52,6.88 X2.P$1
CH_EN_MBED  (via drill 0.35)
  Top 0.305: v82.76,43.07 82.89,42.95 82.89,12.69
  Top 0.406: X4.P$4 82.89,12.69
  Bottom 0.305: v82.76,43.07 75.65,50.19 U1.22
CH_HV_IL
  Bottom 0.406: X4.P$5 96.99,4.64 96.99,6.63 90.38,13.23 R2.1
CON+
  Top 0.305: X7.P$4 44.36,9.04 RESISTOR_NET_2.7K.5
CON+_IN  (via drill 0.35)
  Top 0.305: U$19.5 RESISTOR_NET_2.7K.12 23.33,9.04 23.71,9.42 23.71,15.01 37.04,28.34 v44.28,28.34
  Bottom 0.305: U1.16 65.87,28.34 v44.28,28.34
CON-
  Top 0.305: X7.P$2 39.63,7.77 37.17,7.77 35.9,6.5 RESISTOR_NET_2.7K.3
CON-_IN
  Top 0.305: U$19.3 RESISTOR_NET_2.7K.14 24.34,6.5 24.73,6.88 24.73,13.1 29.93,18.31 60.92,18.31 U1.14
CON_SRC
  Top 0.305: X7.P$6 37.44,3.96 RESISTOR_NET_2.7K.1
CON_SRC_IL
  Top 0.305: X7.P$3 42.12,8.28 36.03,8.28 35.52,7.77 RESISTOR_NET_2.7K.4
CON_SRC_IL_IN
  Top 0.305: U$19.4 RESISTOR_NET_2.7K.13 23.96,7.77 24.22,8.02 24.22,13.99 30.95,20.72 60.79,20.72 U1.15
CON_SRC_IN
  Top 0.305: U$19.1 RESISTOR_NET_2.7K.16 24.98,3.96 25.74,4.72 25.74,10.05 26.63,10.94 68.79,10.94 U1.38
FAN_MBED
  Bottom 0.406: X4.P$2 89.24,12.34 89.24,29.36 83.65,34.95 83.65,37.99 79.08,42.57 U1.19
GND  (via drill 0.35, 3.2)
  Top 0.305: R18.1 46,39.39 C9.2 48.47,41.87 48.47,49.68 47.96,50.2 U$1.GND U$1.SLOW | C4.1 v37.43,53.62 | v31.71,59.58 31.96,59.84 34.82,59.84 C10.2 35.71,58.25 36.66,57.3 43.39,57.3 v44.16,56.54 | LED4.C 76.29,39.65 75.65,39.01 v75.65,38.5 | v27.27,22.88 26.25,22.88 19.77,16.4 v19.77,14.5 17.49,12.21 11.77,12.21 11.14,12.85 U$19.9 | LED3.C 77.14,45.74 v75.91,45.74 | U$1.SLOW | U$1.SLOW v45.68,50.69
  Bottom 0.305: U$4.GND U$4.SLOW v27.27,22.88 | v37.43,53.62 31.71,59.33 v31.71,59.58 | C12.1 19.77,16.22 v19.77,14.5 | R15.1 41.42,21.48 v42.63,21.48
  other vias: 4.81,5 105.65,4.72 100.29,52.85 92.04,24.53
  pour Top (isolate 0.508): 39.63,61.11 39.63,35.24 21.93,17.55 1.61,17.55 1.61,2.94 3.24,1.32 26.67,1.42 107.02,1.42 110.2,4.59 110.2,57.55 106.64,61.11
  pour Bottom (isolate 0.254): 29.81,61.11 107.87,61.11 109.7,59.28 109.56,1.19 4.38,1.19 0.62,4.95 0.6,16.53 0.85,16.79 11.39,16.79 14.12,19.51 14.12,29.99 29.81,29.99
GND1  (via drill 3.2)
  other vias: 91.53,57.32
GND2  (via drill 3.2)
  other vias: 5.07,56.94
ISO_1_N  (via drill 0.35)
  Top 0.305: U$2.7 19.26,37.99 15.96,34.69 v15.96,31.26
  Bottom 0.305: U$4.IM 25.74,9.67 25.74,10.56 25.49,10.82 15.01,10.82 13.87,11.96 R21.1 13.87,16.94 C14.2 15.33,18.73 15.33,28.75 16.64,30.06 16.64,30.87 16.24,31.26 v15.96,31.26
ISO_1_OUT_N
  Top 0.305: J3.2 11.08,23.15 12.46,24.53 12.46,34.11 9.54,37.03 7.83,37.03 6.87,37.99 U$2.4
ISO_1_OUT_P
  Top 0.305: J3.1 11.08,25.15 12.03,26.1 12.03,33.93 9.36,36.6 7.83,36.6 6.69,35.45 U$2.5
ISO_1_P  (via drill 0.35)
  Top 0.305: v18.25,31.26 18.25,34.06 19.65,35.45 U$2.6
  Bottom 0.305: U$4.IP 26.26,12.16 C13.1 25.29,14.09 R20.2 25.29,18.03 23.12,20.2 16.72,20.2 15.96,20.97 15.96,28.52 17.32,29.88 17.32,30.9 17.68,31.26 v18.25,31.26
ISO_2_N
  Top 0.305: U$1.IM 45.26,52.2 R9.1 43.07,55.33 41.74,56.66 33.36,56.66 31.75,55.05 C7.2 31.13,54.5 27.09,50.47 27.09,46.25 25.56,44.73 23.84,44.73 22.95,45.61 U$2.10
ISO_2_OUT_N
  Top 0.305: J1.2 20.79,54.63 16.47,54.63 15.2,55.9 14.06,55.9 12.68,54.52 J2.2 12.68,50.68 13.42,49.93 13.42,47.99 9.99,44.56 8.32,44.56 7.26,45.61 U$2.1
ISO_2_OUT_P
  Top 0.305: J1.1 24.73,52.69 24.73,50.69 23.58,49.55 18.09,49.55 J2.1 14.68,50.75 13.85,49.93 13.85,47.81 10.17,44.13 8.32,44.13 7.26,43.07 U$2.2
ISO_2_P
  Top 0.305: U$1.IP 45.5,51.7 C6.1 43.1,48.24 41.87,47.01 33.05,47.01 31.65,48.41 R19.2 31.65,51.52 30.57,52.6 29.83,52.6 27.52,50.29 27.52,46.07 25.74,44.29 23.84,44.29 22.62,43.07 U$2.9
LV_CURR_SENS
  Top 0.305: X7.P$5 46.09,10.31 RESISTOR_NET_2.7K.6
LV_CURR_SENS_IN  (via drill 0.35)
  Top 0.305: U$19.6 17.23,10.31 | 17.23,10.31 RESISTOR_NET_2.7K.11 | 17.23,10.31 21.68,14.75 21.68,16.15 36.66,31.14 v46.82,31.14
  Bottom 0.305: U1.17 66.13,31.14 v46.82,31.14
MBED_CAN_RX_A
  Bottom 0.305: U$5.4 61.05,8.53 59.52,7.01 U1.30
MBED_CAN_TX_A
  Bottom 0.305: U$5.1 57.49,4.72 U1.31
MBED_CH_HV_IL_IN
  Bottom 0.406: R2.2 R3.1 89.99,47.54 84.67,52.85 72.6,52.85 U1.23
N$2
  Top 0.305: R4.2 68.4,8.02 72.46,12.09 U1.37
N$3
  Bottom 0.813: F1.P$1 96.73,13.28 S1.2
N$4
  Bottom 0.305: R5.2 66.27,3.97 67.02,4.72 U$5.8
N$7
  Bottom 0.305: R1.2 56.98,29.61 U1.11
N$8
  Bottom 0.305: R6.2 53.16,26.06 54.43,27.33 U1.12
N$9  (via drill 0.35)
  Top 0.305: v54.44,52.6 55.08,53.23 55.08,57.03 54.06,58.04 R8.2
  Bottom 0.305: U1.10 54.95,34.69 54.95,52.09 v54.44,52.6
N$10
  Bottom 0.305: R7.2 71.21,26.06 U1.13
N$11
  Top 0.813: IC1.3 104.99,44.32 104.48,43.82 104.48,29.4 C2.1
  Top 1.016: C2.1 104.48,29.32 +5V1.2
N$12
  Top 0.305: R18.2 41.68,39.77 R17.2 41.68,44.92 46.46,49.7 U$1.ICMP
N$13
  Top 0.813: R10.1 101.05,25.48 99.4,23.83 95.44,23.83 LED1.A
N$14
  Top 0.305: U$1.IBIAS 46.7,49.2 46.7,42.25 C9.1 44.79,42.12 R17.1
N$16
  Bottom 0.305: R13.2 43.01,23.58 42,22.56 R15.2 40.03,22.56 28.26,10.8 U$4.ICMP
N$17
  Bottom 0.305: U$4.IBIAS 28.76,10.03 33.62,14.88 38.51,14.88 40.03,16.4 C11.1
  Bottom 0.406: C11.1 44.41,21.3 R13.1
N$18
  Top 0.305: R25.1 80.26,50.21 LED3.A
N$19
  Bottom 0.305: R20.1 23.9,17.42 23.9,14.91 23.11,14.12 C13.2 22.99,13.48 16.02,13.48 R21.2 15.77,14.12 17.55,15.9 17.56,15.9 C12.2 18.08,16.43 18.08,17.67 C14.1
N$20
  Top 0.305: R9.2 41.17,49.52 C6.2 40.95,49.74 C4.2 37.52,49.65 34.15,49.65 R19.1 33.45,49.14 C7.1
N$21
  Top 0.305: R24.1 79.9,39.75 LED4.A
N$22
  Top 0.305: R26.2 79.9,33.01 LED2.A
N$27
  Bottom 0.305: U$5.5 69.43,8.53 71.84,10.94 SPLIT_R4.2 SPLIT_C1.1 81.13,13.1 82.65,13.1 83.78,14.23 SPLIT_R3.2
N$46
  Bottom 0.305: S4.D 98.64,20.69 S4.6
  Bottom 0.406: S4.1 S4.2 S4.5 S4.6
  Bottom 1.016: S4.D 97.51,21.05 92.67,21.05 F1.P$2
N$62
  Top 0.813: R57.1 91.15,35.22 91.15,49.81 84.16,56.79 C1.1 81.86,59.22 80.73,60.35 U1.VIN
PEC_ERR
  Top 0.305: U1.9 63.71,34.95 67.52,38.76 73.56,38.76 75.21,37.11 76.73,37.11 77.37,36.47 R26.1
PRE_MECH
  Top 0.305: X7.P$1 37.14,5.23 RESISTOR_NET_2.7K.2
PRE_MECH_IN
  Top 0.305: U$19.2 RESISTOR_NET_2.7K.15 24.6,5.23 25.23,5.86 25.23,12.21 28.92,15.9 68.79,15.9 72.48,19.58 U1.40
SUPPLY
  Top 0.813: S1.3 99.29,9.39 99.27,9.39 99.27,6.93 X4.P$3
TEMP_ERR
  Top 0.305: U1.8 64.22,37.49 70.57,43.84 77.62,43.84 R24.2
USB_GND
  Top 0.406: U1.USB_GND2 U1.USB_GND1
VOLTAGE_ERR
  Top 0.305: U1.7 60.03,40.03 62.95,42.95 62.95,50.19 64.22,51.46 77.12,51.46 R25.2

### Text on the board
tPlace: HM2100L | 60E | 60E | 4k7
bPlace: 1k | 2.7k | 10uF | 100nF | zener
tNames: IM | IP | IM | IP | VLT | TEMP | PEC | MOSI | MISO | IP | SCK | IM | AMS MASTER_3 / Designed by / - SOHAM / - SAURABH | GND